# EAGLE design multiple valve controller v2.0 (EAGLE 9.6.2)
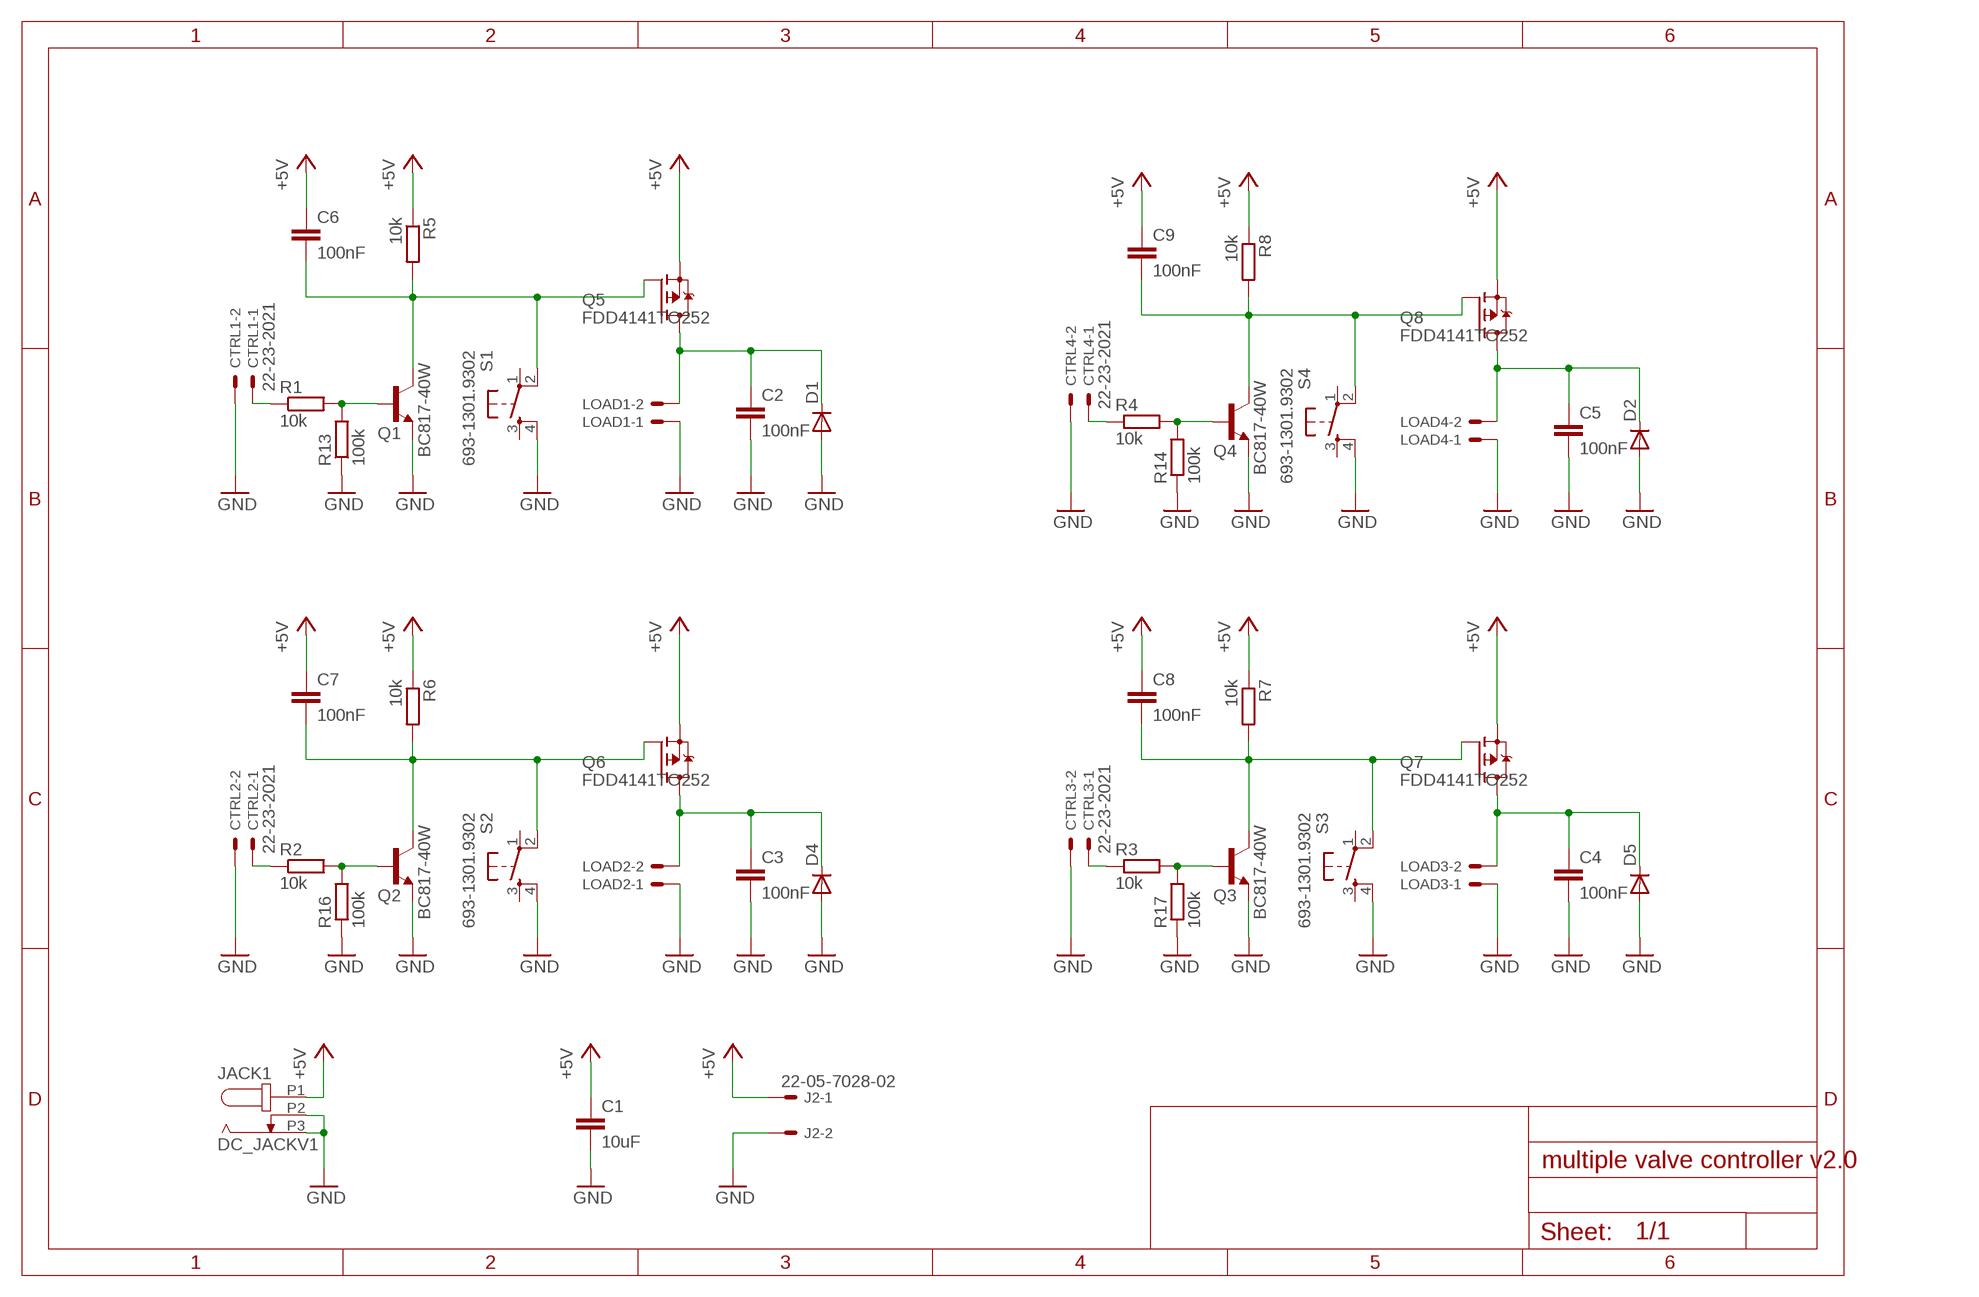
[diagram p0: schematic, sheet 1, part 1 of 2]
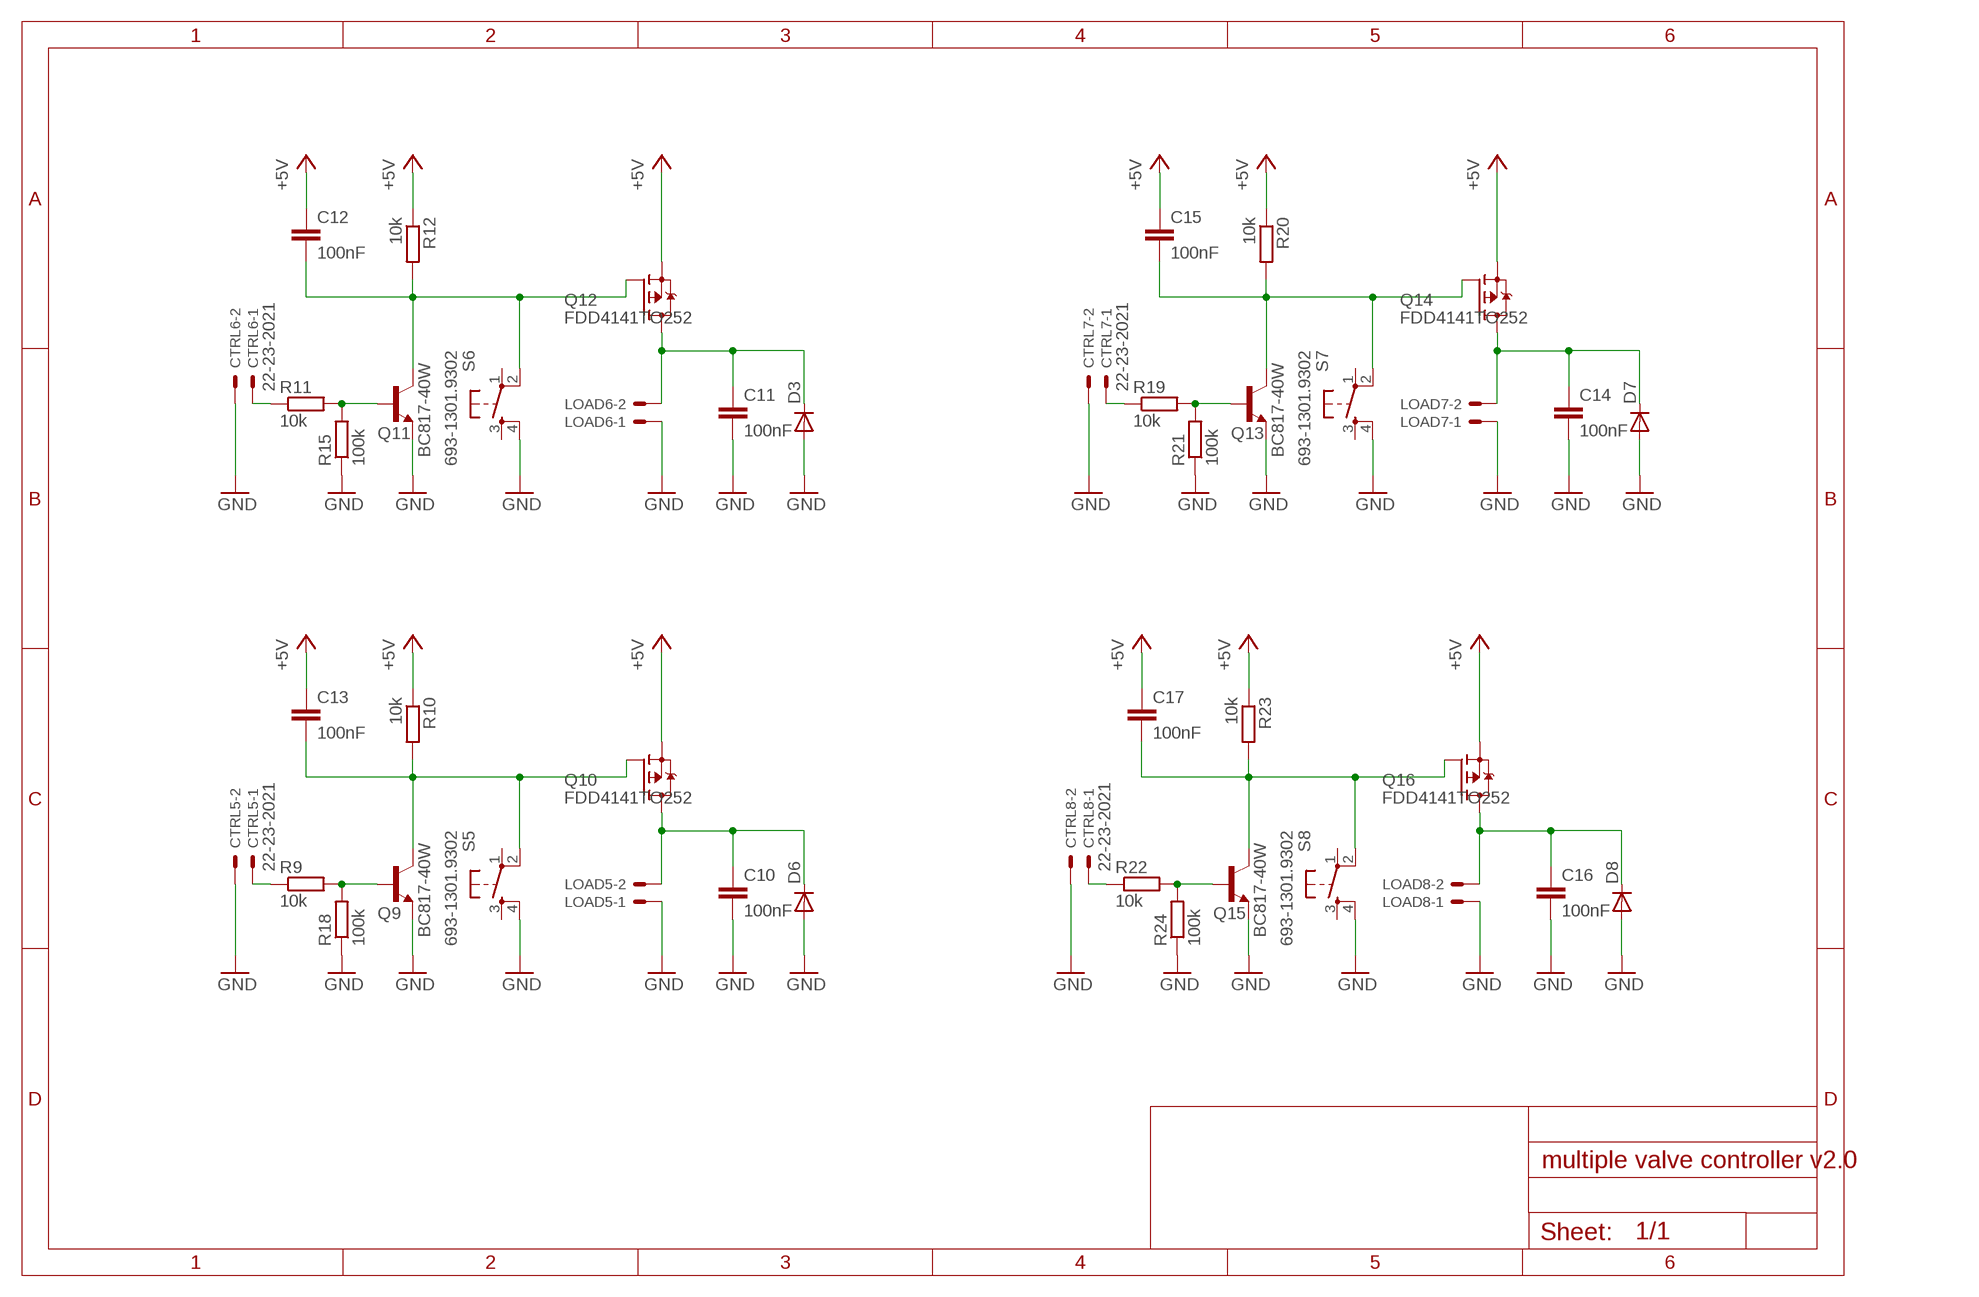
[diagram p1: schematic, sheet 1, part 2 of 2]

## Parts
C1  10uF  C-EUC1210  [C1210]
C2  100nF  C-EUC1210  [C1210]
C3  100nF  C-EUC1210  [C1210]
C4  100nF  C-EUC1210  [C1210]
C5  100nF  C-EUC1210  [C1210]
C6  100nF  C-EUC0603  [C0603]
C7  100nF  C-EUC0603  [C0603]
C8  100nF  C-EUC0603  [C0603]
C9  100nF  C-EUC0603  [C0603]
C10  100nF  C-EUC1210  [C1210]
C11  100nF  C-EUC1210  [C1210]
C12  100nF  C-EUC0603  [C0603]
C13  100nF  C-EUC0603  [C0603]
C14  100nF  C-EUC1210  [C1210]
C15  100nF  C-EUC0603  [C0603]
C16  100nF  C-EUC1210  [C1210]
C17  100nF  C-EUC0603  [C0603]
CTRL1  22-23-2021  [22-23-2021]
CTRL2  22-23-2021  [22-23-2021]
CTRL3  22-23-2021  [22-23-2021]
CTRL4  22-23-2021  [22-23-2021]
CTRL5  22-23-2021  [22-23-2021]
CTRL6  22-23-2021  [22-23-2021]
CTRL7  22-23-2021  [22-23-2021]
CTRL8  22-23-2021  [22-23-2021]
D1  DIODE-SOD323-R  [SOD323-R]
D2  DIODE-SOD323-R  [SOD323-R]
D3  DIODE-SOD323-R  [SOD323-R]
D4  DIODE-SOD323-R  [SOD323-R]
D5  DIODE-SOD323-R  [SOD323-R]
D6  DIODE-SOD323-R  [SOD323-R]
D7  DIODE-SOD323-R  [SOD323-R]
D8  DIODE-SOD323-R  [SOD323-R]
J2  22-05-7028-02  [7395-02]
JACK1  DC_JACKV1  [DC_POWER_INPUT]
LOAD1  22-23-2021  [22-23-2021]
LOAD2  22-23-2021  [22-23-2021]
LOAD3  22-23-2021  [22-23-2021]
LOAD4  22-23-2021  [22-23-2021]
LOAD5  22-23-2021  [22-23-2021]
LOAD6  22-23-2021  [22-23-2021]
LOAD7  22-23-2021  [22-23-2021]
LOAD8  22-23-2021  [22-23-2021]
Q1  BC817-40W  BC817  [SOT323-BEC]
Q2  BC817-40W  BC817  [SOT323-BEC]
Q3  BC817-40W  BC817  [SOT323-BEC]
Q4  BC817-40W  BC817  [SOT323-BEC]
Q5  FDD4141TO252  [TO252]
Q6  FDD4141TO252  [TO252]
Q7  FDD4141TO252  [TO252]
Q8  FDD4141TO252  [TO252]
Q9  BC817-40W  BC817  [SOT323-BEC]
Q10  FDD4141TO252  [TO252]
Q11  BC817-40W  BC817  [SOT323-BEC]
Q12  FDD4141TO252  [TO252]
Q13  BC817-40W  BC817  [SOT323-BEC]
Q14  FDD4141TO252  [TO252]
Q15  BC817-40W  BC817  [SOT323-BEC]
Q16  FDD4141TO252  [TO252]
R1  10k  R-EU_R0402  [R0402]
R2  10k  R-EU_R0402  [R0402]
R3  10k  R-EU_R0402  [R0402]
R4  10k  R-EU_R0402  [R0402]
R5  10k  R-EU_R0603  [R0603]
R6  10k  R-EU_R0603  [R0603]
R7  10k  R-EU_R0603  [R0603]
R8  10k  R-EU_R0603  [R0603]
R9  10k  R-EU_R0402  [R0402]
R10  10k  R-EU_R0603  [R0603]
R11  10k  R-EU_R0402  [R0402]
R12  10k  R-EU_R0603  [R0603]
R13  100k  R-EU_R0402  [R0402]
R14  100k  R-EU_R0402  [R0402]
R15  100k  R-EU_R0402  [R0402]
R16  100k  R-EU_R0402  [R0402]
R17  100k  R-EU_R0402  [R0402]
R18  100k  R-EU_R0402  [R0402]
R19  10k  R-EU_R0402  [R0402]
R20  10k  R-EU_R0603  [R0603]
R21  100k  R-EU_R0402  [R0402]
R22  10k  R-EU_R0402  [R0402]
R23  10k  R-EU_R0603  [R0603]
R24  100k  R-EU_R0402  [R0402]
S1  693-1301.9302  TAC_SWITCHPTH  [TACTILE-PTH]
S2  693-1301.9302  TAC_SWITCHPTH  [TACTILE-PTH]
S3  693-1301.9302  TAC_SWITCHPTH  [TACTILE-PTH]
S4  693-1301.9302  TAC_SWITCHPTH  [TACTILE-PTH]
S5  693-1301.9302  TAC_SWITCHPTH  [TACTILE-PTH]
S6  693-1301.9302  TAC_SWITCHPTH  [TACTILE-PTH]
S7  693-1301.9302  TAC_SWITCHPTH  [TACTILE-PTH]
S8  693-1301.9302  TAC_SWITCHPTH  [TACTILE-PTH]

## Nets
+5V: C1.1 C6.1 C7.1 C8.1 C9.1 C12.1 C13.1 C15.1 C17.1 J2.1 JACK1.P1 Q5.2(S) Q6.2(S) Q7.2(S) Q8.2(S) Q10.2(S) Q12.2(S) Q14.2(S) Q16.2(S) R5.1 R6.1 R7.1 R8.1 R10.1 R12.1 R20.1 R23.1
GND: C1.2 C2.2 C3.2 C4.2 C5.2 C10.2 C11.2 C14.2 C16.2 CTRL1.2 CTRL2.2 CTRL3.2 CTRL4.2 CTRL5.2 CTRL6.2 CTRL7.2 CTRL8.2 D1.A D2.A D3.A D4.A D5.A D6.A D7.A D8.A J2.2 JACK1.P2 JACK1.P3 LOAD1.1 LOAD2.1 LOAD3.1 LOAD4.1 LOAD5.1 LOAD6.1 LOAD7.1 LOAD8.1 Q1.E Q2.E Q3.E Q4.E Q9.E Q11.E Q13.E Q15.E R13.1 R14.1 R15.1 R16.1 R17.1 R18.1 R21.1 R24.1 S1.4 S2.4 S3.4 S4.4 S5.4 S6.4 S7.4 S8.4
N$1: CTRL1.1 R1.1
N$2: C3.1 D4.C LOAD2.2 Q6.3(D)
N$3: C8.2 Q3.C Q7.1(G) R7.2 S3.2
N$4: Q2.B R2.2 R16.2
N$5: CTRL2.1 R2.1
N$6: C4.1 D5.C LOAD3.2 Q7.3(D)
N$7: C13.2 Q9.C Q10.1(G) R10.2 S5.2
N$8: Q3.B R3.2 R17.2
N$9: C2.1 D1.C LOAD1.2 Q5.3(D)
N$10: CTRL3.1 R3.1
N$11: C5.1 D2.C LOAD4.2 Q8.3(D)
N$12: C12.2 Q11.C Q12.1(G) R12.2 S6.2
N$13: Q4.B R4.2 R14.2
N$14: CTRL4.1 R4.1
N$17: C7.2 Q2.C Q6.1(G) R6.2 S2.2
N$18: C9.2 Q4.C Q8.1(G) R8.2 S4.2
N$19: Q1.B R1.2 R13.2
N$25: C15.2 Q13.C Q14.1(G) R20.2 S7.2
N$31: C17.2 Q15.C Q16.1(G) R23.2 S8.2
N$49: C10.1 D6.C LOAD5.2 Q10.3(D)
N$51: Q9.B R9.2 R18.2
N$52: CTRL5.1 R9.1
N$53: C11.1 D3.C LOAD6.2 Q12.3(D)
N$55: Q11.B R11.2 R15.2
N$56: CTRL6.1 R11.1
N$61: C6.2 Q1.C Q5.1(G) R5.2 S1.2
N$150: C14.1 D7.C LOAD7.2 Q14.3(D)
N$170: Q13.B R19.2 R21.2
N$200: CTRL7.1 R19.1
N$210: C16.1 D8.C LOAD8.2 Q16.3(D)
N$230: Q15.B R22.2 R24.2
N$240: CTRL8.1 R22.1
Unconnected: S1.1 S1.3 S2.1 S2.3 S3.1 S3.3 S4.1 S4.3 S5.1 S5.3 S6.1 S6.3 S7.1 S7.3 S8.1 S8.3

## Library data of the parts
C1-C17 = rcl:C-EU: CAPACITOR, European symbol
CTRL1-CTRL8 LOAD1-LOAD8 = con-molex:22-23-2021: .100" (2.54mm) Center Header - 2 Pin; MF: MOLEX; MPN: 22-23-2021; OC_FARNELL: 1462926; OC_NEWARK: 25C3832
D1-D8 = diode:DIODE-: DIODE
J2 = con-molex:22-?-02: CONNECTOR wire to board 2.54 mm (.1 inch) pitch header; OC_FARNELL: 9731601; OC_NEWARK: unknown
JACK1 = CNP-miscellaneous:DC_JACK
Q1-Q4 Q9 Q11 Q13 Q15 = transistor-npn:BC817*: NPN Transistor
Q5-Q8 Q10 Q12 Q14 Q16 = transistor-fet:FDD4141: P-Channel PowerTrench® MOSFET Source: FDD4141.pdf
R1-R24 = rcl:R-EU_: RESISTOR, European symbol
S1-S8 = SparkFun-Electromechanical:TAC_SWITCH: Momentary Switch Button commonly used for reset or general input. Spark Fun Electronics SKU : COM-00097 SMT- SWCH-08247

## Board
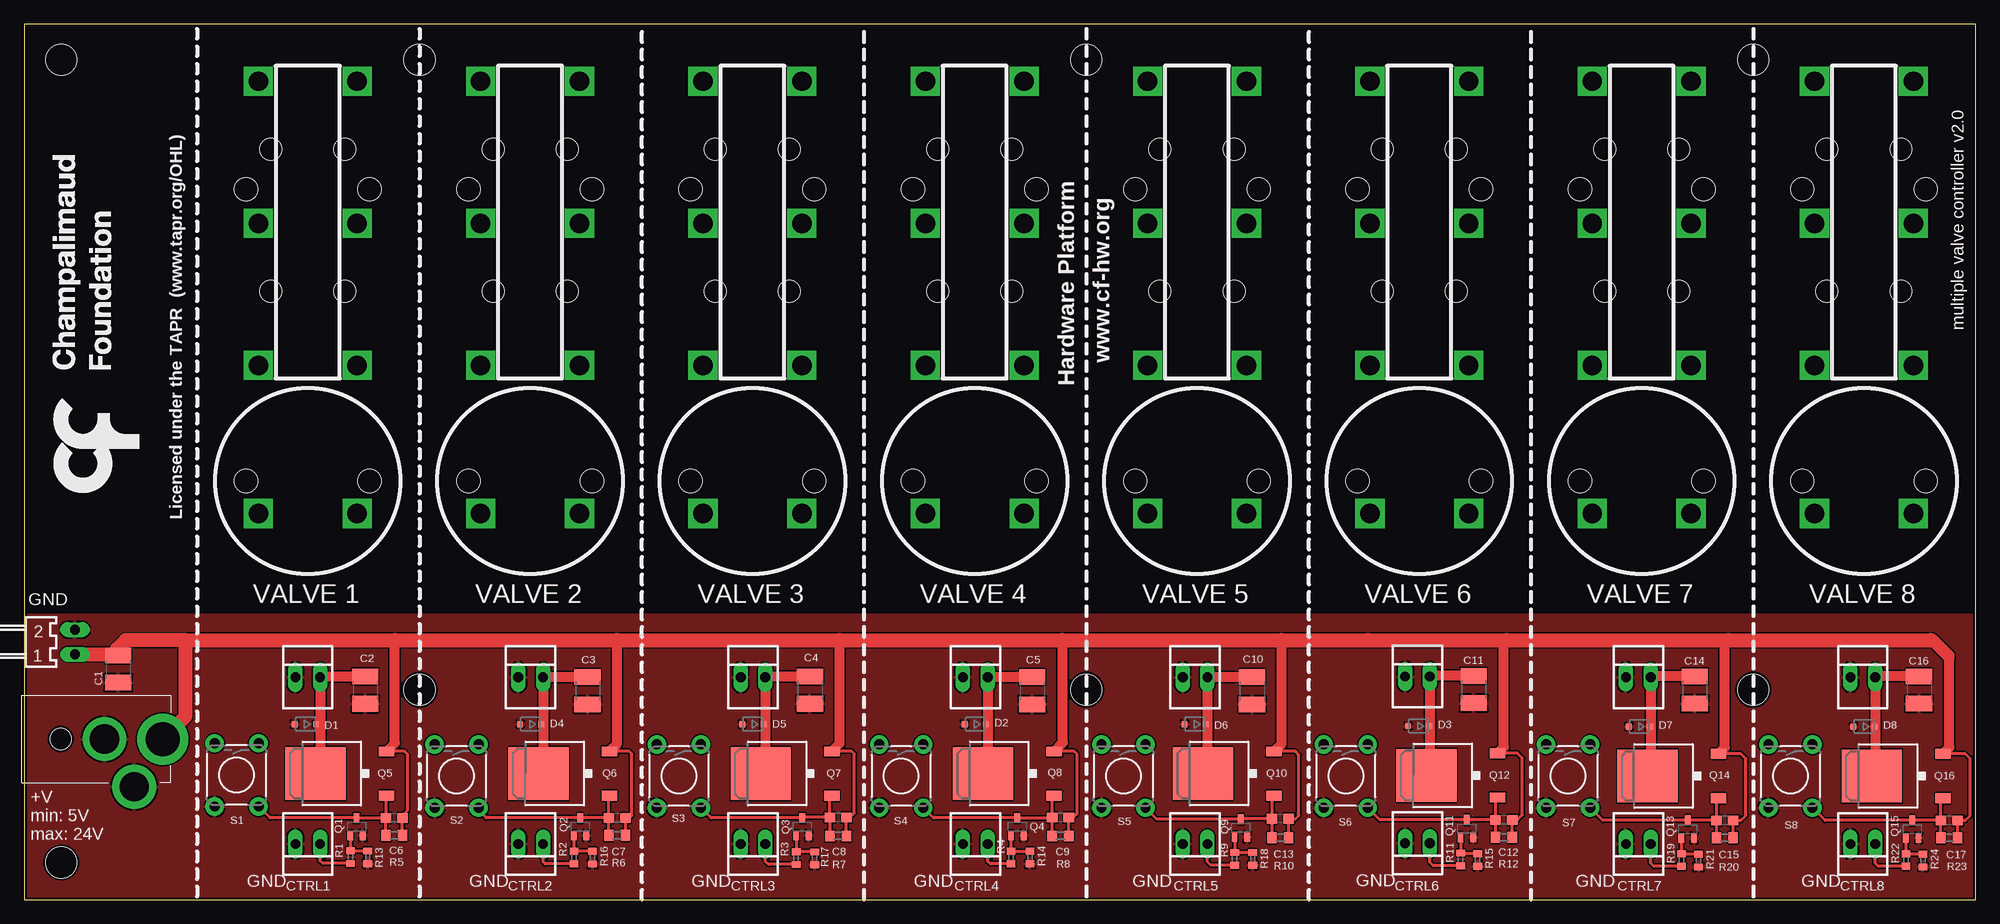
[diagram p2: board, top side]
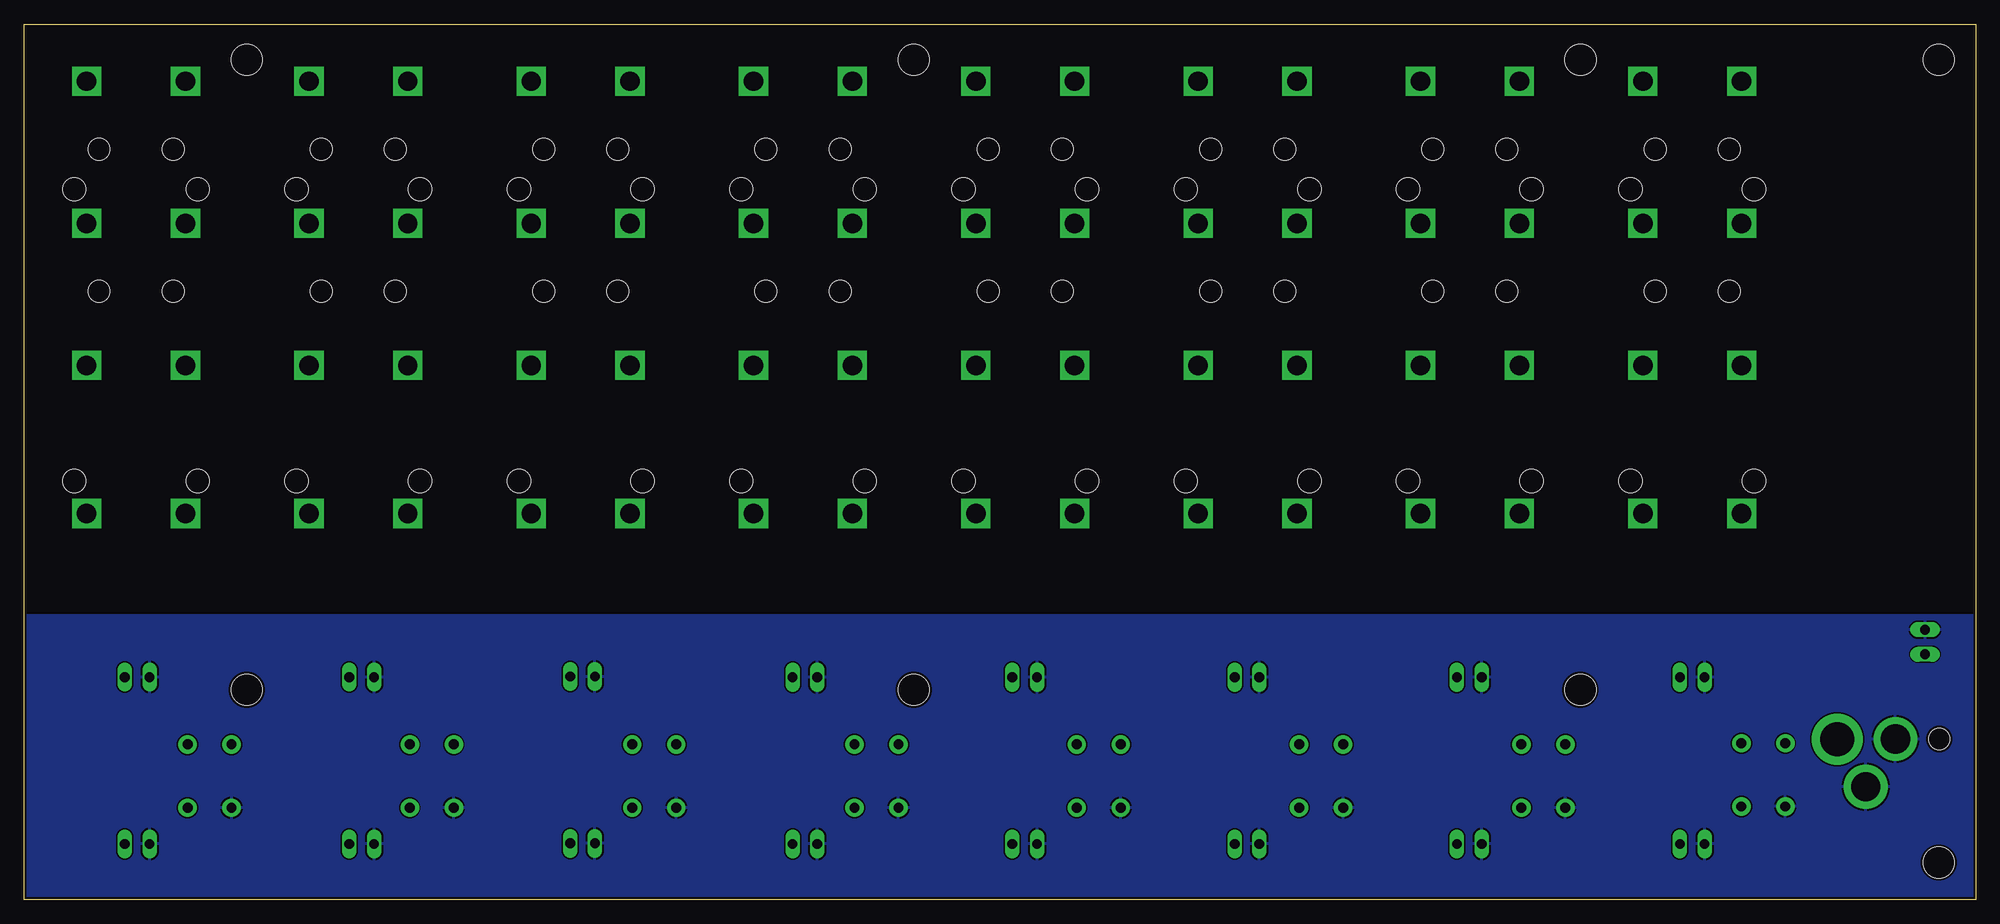
[diagram p3: board, bottom side, seen from below]

Size 200.66 x 90 mm. Coordinates in mm from the lower left corner, seen from the top.
Outline: 0,0 200.66,0 200.66,90 0,90 0,0
Copper layers (1*16): Top 0.018mm / dielectric 1.55mm / Bottom 0.018mm
Design rules "eC_2Layer_PClass6_BaseCopperO18_eCDefault": minimum track width 0.15mm, minimum drill 0.35mm, track to track 0.15mm, track to pad 0.15mm, pad to pad 0.15mm, via to via 0.15mm, smd to smd 0mil, copper to edge 0.25mm, drill to drill 0.35mm, minimum pad ring 0.175mm, minimum via ring 0.125mm, stop-mask expansion 0mil, vias tented up to drill 0.45mm, thermal gap 0.2mm
Holes 3.2 mm at 177.8,86.36 3.81,3.81 109.22,86.36 40.64,86.36 3.81,86.36 177.8,21.59 109.22,21.59 40.64,21.59
Holes 2.26 mm at 124.4,77.16 116.78,77.16 124.4,62.55 116.78,62.55 147.26,77.16 139.64,77.16 147.26,62.55 139.64,62.55 170.12,77.16 162.5,77.16 170.12,62.55 162.5,62.55 192.98,77.16 185.36,77.16 192.98,62.55 185.36,62.55 32.96,77.16 25.34,77.16 32.96,62.55 25.34,62.55 55.82,77.16 48.2,77.16 55.82,62.55 48.2,62.55 78.68,77.16 71.06,77.16 78.68,62.55 71.06,62.55 101.54,77.16 93.92,77.16 101.54,62.55 93.92,62.55
Holes 2.4 mm at 114.24,43.04 126.94,43.04 114.24,73.04 126.94,73.04 137.1,43.04 149.8,43.04 137.1,73.04 149.8,73.04 159.96,43.04 172.66,43.04 159.96,73.04 172.66,73.04 182.82,43.04 195.52,43.04 182.82,73.04 195.52,73.04 22.8,43.04 35.5,43.04 22.8,73.04 35.5,73.04 45.66,43.04 58.36,43.04 45.66,73.04 58.36,73.04 68.52,43.04 81.22,43.04 68.52,73.04 81.22,73.04 91.38,43.04 104.08,43.04 91.38,73.04 104.08,73.04

### Footprints (pad centres in the part's own frame; a part is rotated, then mirrored left to right if it is on the bottom)
C1210 = smd 1.6 x 2.7: 1 -1.4,0; 2 1.4,0
C0603 = smd 1.1 x 1: 1 -0.85,0; 2 0.85,0
22-23-2021 = drill 1 long: 1 -1.27,0; 2 1.27,0
SOD323-R = smd 0.6 x 0.6: A 1.1,0; C -1.1,0
7395-02 = drill 1.016 long: 1 1.27,0; 2 -1.27,0
DC_POWER_INPUT = drill 3.5: P1 8.5,0 | drill 3: P2 2.5,0; P3 5.55,-4.9 | hole 2.2: -2,0
SOT323-BEC = smd 0.6 x 1: B -0.65,-0.9; C 0,0.9; E 0.65,-0.9
TO252 = smd 1 x 1.6: 1 -2.28,-4.8; 2 2.28,-4.8 | smd 5.4 x 6.2: 3 0,2.5
R0402 = smd 0.7 x 0.9: 1 -0.65,0; 2 0.65,0
R0603 = smd 1 x 1.1: 1 -0.85,0; 2 0.85,0
TACTILE-PTH = drill 1.016 pad 1.88: 1 -3.251,2.261; 2 3.251,2.261; 3 -3.251,-2.261; 4 3.251,-2.261

### Placement (x,y rotation side)
C1  9.67,23.7 270 top
C2  35.06,21.53 270 top
C3  57.92,21.47 270 top
C4  80.78,21.53 270 top
C5  103.64,21.47 270 top
C6  38.04,8.38 180 top
C7  60.96,8.38 180 top
C8  83.69,8.45 180 top
C9  106.55,8.45 180 top
C10  126.25,21.47 270 top
C11  149.05,21.6 270 top
C12  152.15,8.19 180 top
C13  129.16,8.32 180 top
C14  171.76,21.54 270 top
C15  174.86,8.13 180 top
C16  194.84,21.54 270 top
C17  197.94,8.13 180 top
CTRL1  29.15,5.71 180 top
CTRL2  52.07,5.71 180 top
CTRL3  74.93,5.71 180 top
CTRL4  97.79,5.71 180 top
CTRL5  120.4,5.71 180 top
CTRL6  143.26,5.78 180 top
CTRL7  165.97,5.72 180 top
CTRL8  189.05,5.72 180 top
D1  28.89,18.03 180 top
D2  97.79,18.03 180 top
D3  143.38,17.84 180 top
D4  52.07,18.03 180 top
D5  74.93,18.03 180 top
D6  120.4,18.03 180 top
D7  166.1,17.78 180 top
D8  189.18,17.78 180 top
J2  5.21,26.49 270 top
JACK1  5.75,16.5 0 top
LOAD1  29.15,22.86 0 top
LOAD2  52.07,22.86 0 top
LOAD3  74.93,22.86 0 top
LOAD4  97.79,22.86 0 top
LOAD5  120.4,22.86 0 top
LOAD6  143.26,22.92 0 top
LOAD7  165.97,22.86 0 top
LOAD8  189.05,22.86 0 top
Q1  34.16,7.49 0 top
Q2  57.15,7.49 0 top
Q3  80.01,7.49 0 top
Q4  102.11,7.49 0 top
Q5  32.45,12.95 90 top
Q6  55.37,12.95 90 top
Q7  78.23,12.95 90 top
Q8  101.09,12.95 90 top
Q9  125.09,7.37 0 top
Q10  123.7,12.95 90 top
Q11  148.34,7.3 0 top
Q12  146.69,12.76 90 top
Q13  171.05,7.24 0 top
Q14  169.4,12.7 90 top
Q15  194.13,7.24 0 top
Q16  192.48,12.7 90 top
R1  33.55,4.36 90 top
R2  56.52,4.32 90 top
R3  79.37,4.25 90 top
R4  101.47,4.32 90 top
R5  38.04,6.6 180 top
R6  60.96,6.6 180 top
R7  83.69,6.54 180 top
R8  106.55,6.54 180 top
R9  124.46,4.19 90 top
R10  129.16,6.36 180 top
R11  147.7,4.13 90 top
R12  152.15,6.41 180 top
R13  35.31,4.34 90 top
R14  103.41,4.32 90 top
R15  149.44,4.07 90 top
R16  58.43,4.31 90 top
R17  81.27,4.24 90 top
R18  126.32,4.18 90 top
R19  170.41,4.07 90 top
R20  174.86,6.35 180 top
R21  172.16,4.01 90 top
R22  193.5,4.07 90 top
R23  197.94,6.35 180 top
R24  195.24,4.01 90 top
S1  21.83,12.82 270 top
S2  44.45,12.7 270 top
S3  67.31,12.7 270 top
S4  90.17,12.7 270 top
S5  113.03,12.7 270 top
S6  135.89,12.7 270 top
S7  158.75,12.7 270 top
S8  181.61,12.7 270 top
U$1  [LOGO_5]  6.1,44.91 90 top

### Tracks (layer width: path | path; a pad name or v marks a point on that pad's centre or on a via)
+5V
  Top 0.305: R7.1 C8.1 84.9,8.45 85.34,8.89 85.34,14.99 85.09,15.24 Q7.2 | R5.1 C6.1 38.89,8.66 39.37,9.14 39.37,14.99 39.24,15.11 39.12,15.24 Q5.2 | R10.1 C13.1 130.75,8.32 131.06,8.64 131.06,14.86 130.68,15.24 Q10.2 | R12.1 C12.1 153.54,8.19 154.05,8.7 154.05,14.54 153.54,15.05 Q12.2 | R6.1 C7.1 62.23,8.38 62.48,8.64 62.48,14.99 62.23,15.24 Q6.2 | R8.1 C9.1 107.89,8.45 108.27,8.83 108.27,14.92 107.95,15.24 Q8.2 | R20.1 C15.1 176.51,8.13 177.02,8.64 177.02,14.48 176.51,14.99 Q14.2 | R23.1 C17.1 199.59,8.13 200.1,8.64 200.1,14.48 199.59,14.99 Q16.2
  Top 1.016: 129.29,26.67 129.29,16.02 Q10.2 | 134.56,26.86 138.18,26.67 | Q12.2 152.15,15.7 152.15,26.42 152.4,26.67 | Q14.2 174.86,15.64 174.86,26.27 175.26,26.67 | 197.94,24.77 197.94,15.64 Q16.2 | 196.04,26.67 197.94,24.77 | 196.23,26.86 197.94,25.15 197.94,24.77 | Q6.2 60.96,16.02 60.96,26.67 | Q7.2 83.82,16.02 83.82,26.67 | Q8.2 106.81,16.15 106.81,26.54 106.68,26.67 | Q5.2 38.1,16.09 38.1,26.67
  Top 1.422: 16.54,26.67 38.1,26.67 60.96,26.67 83.82,26.67 106.68,26.67 129.29,26.67 138.18,26.67 152.4,26.67 175.26,26.67 196.03,26.67 196.04,26.67 | 16.54,26.67 16.54,18.79 JACK1.P1 | 16.54,26.67 10.42,26.67 9.55,25.8 9.55,25.22 | J2.1 9.55,25.22 | 9.55,25.22 C1.1
GND
  pour Top: 0,0 200.66,0 200.66,29.21 0,29.21
  pour Bottom: 0,0 200.66,0 200.66,29.21 0,29.21
N$1
  Top 0.305: R1.1 30.7,3.71 30.43,3.98 CTRL1.1
N$2
  Top 0.305: D4.C 53.34,18.03
  Top 0.406: 58.67,22.69 C3.1
  Top 1.016: 53.34,22.82 LOAD2.2 | LOAD2.2 53.34,18.03 53.34,13.42 Q6.3 | C3.1 LOAD2.2
N$3
  Top 0.305: C8.2 R7.2 | C8.2 80.06,8.45 Q3.C 70.63,8.39 S3.2 | C8.2 82.84,10.48 Q7.1
N$4
  Top 0.305: Q2.B 56.5,4.98 R2.2 56.53,4.96 R16.2
N$5
  Top 0.305: R2.1 53.55,3.67 53.34,3.87 CTRL2.1
N$6
  Top 0.305: D5.C 76.2,18.03
  Top 0.406: 81.79,22.69 C4.1
  Top 1.016: 76.2,22.88 LOAD3.2 | LOAD3.2 76.2,18.03 76.2,13.42 Q7.3 | C4.1 76.28,22.93 LOAD3.2
N$7
  Top 0.305: R10.2 C13.2 | C13.2 125.15,8.32 Q9.C 116.47,8.27 S5.2 | Q10.1 128.31,10.48 C13.2
N$8
  Top 0.305: Q3.B 79.36,4.92 R3.2 79.38,4.89 R17.2
N$9
  Top 0.305: D1.C 30.42,18.03
  Top 1.016: 30.42,22.88 LOAD1.2 | LOAD1.2 30.42,18.03 30.42,13.68 Q5.3 | C2.1 30.49,22.93 LOAD1.2
N$10
  Top 0.305: R3.1 76.53,3.6 76.2,3.94 CTRL3.1
N$11
  Top 0.305: D2.C 99.06,18.03
  Top 0.406: 101.6,22.69 C5.1
  Top 1.016: Q8.3 99.06,13.42 99.06,18.03 LOAD4.2 C5.1
N$12
  Top 0.305: R12.2 C12.2 | C12.2 151.3,10.29 Q12.1 | S6.2 139.4,8.2 Q11.C C12.2
N$13
  Top 0.305: Q4.B 101.46,4.98 R4.2 R14.2
N$14
  Top 0.305: R4.1 99.33,3.67 99.06,3.94 CTRL4.1
N$15  (via drill 2)
  other vias: 24.07,54.94
N$16  (via drill 2)
  other vias: 34.23,54.94
N$17
  Top 0.305: R6.2 C7.2 | S2.2 46.71,9.17 47.49,8.39 Q2.C 60.1,8.39 C7.2 | C7.2 60.11,10.61 Q6.1
N$18
  Top 0.305: R8.2 C9.2 | 105.7,8.25 105.7,8.18 | 105.7,8.25 C9.2 | 105.7,8.25 105.56,8.39 Q4.C 93.49,8.39 S4.2 | C9.2 105.7,10.48 Q8.1
N$19
  Top 0.305: R13.2 35.29,5.01 R1.2 33.51,5.05 Q1.B
N$20  (via drill 2)
  other vias: 24.07,69.54
N$21  (via drill 2)
  other vias: 34.23,69.54
N$22  (via drill 2)
  other vias: 34.23,84.14
N$23  (via drill 2)
  other vias: 24.07,84.14
N$24  (via drill 2)
  other vias: 34.23,39.7
N$25
  Top 0.305: R20.2 C15.2 | C15.2 174.01,10.23 Q14.1 | S7.2 162.32,8.14 Q13.C C15.2
N$26  (via drill 2)
  other vias: 24.07,39.7
N$27  (via drill 2)
  other vias: 46.93,54.94
N$28  (via drill 2)
  other vias: 57.09,54.94
N$29  (via drill 2)
  other vias: 46.93,69.54
N$30  (via drill 2)
  other vias: 57.09,69.54
N$31
  Top 0.305: R23.2 C17.2 | C17.2 197.09,10.23 Q16.1 | S8.2 185.18,8.14 Q15.C 194.14,8.13 C17.2
N$32  (via drill 2)
  other vias: 115.51,54.94
N$33  (via drill 2)
  other vias: 57.09,84.14
N$34  (via drill 2)
  other vias: 46.93,84.14
N$35  (via drill 2)
  other vias: 57.09,39.7
N$36  (via drill 2)
  other vias: 46.93,39.7
N$37  (via drill 2)
  other vias: 69.79,54.94
N$38  (via drill 2)
  other vias: 79.95,54.94
N$39  (via drill 2)
  other vias: 69.79,69.54
N$40  (via drill 2)
  other vias: 79.95,69.54
N$41  (via drill 2)
  other vias: 79.95,84.14
N$42  (via drill 2)
  other vias: 69.79,84.14
N$43  (via drill 2)
  other vias: 79.95,39.7
N$44  (via drill 2)
  other vias: 69.79,39.7
N$45  (via drill 2)
  other vias: 92.65,54.94
N$46  (via drill 2)
  other vias: 102.81,54.94
N$47  (via drill 2)
  other vias: 92.65,69.54
N$48  (via drill 2)
  other vias: 102.81,69.54
N$49
  Top 0.305: D6.C 121.67,18.03
  Top 0.406: 127,22.69 C10.1
  Top 1.016: 121.67,22.82 LOAD5.2 | LOAD5.2 121.67,18.03 121.67,13.42 Q10.3 | C10.1 LOAD5.2
N$50  (via drill 2)
  other vias: 125.67,54.94
N$51
  Top 0.305: Q9.B 124.44,4.86 R9.2 R18.2
N$52
  Top 0.305: R9.1 122,3.54 121.67,3.87 CTRL5.1
N$53
  Top 0.305: D3.C 144.53,17.84
  Top 0.406: 150.05,22.75 C11.1
  Top 1.016: 144.53,22.95 LOAD6.2 | LOAD6.2 144.53,17.84 144.53,13.1 Q12.3 | C11.1 144.6,23 LOAD6.2
N$54  (via drill 2)
  other vias: 115.51,69.54
N$55
  Top 0.305: Q11.B 147.69,4.79 R11.2 149.63,4.78 R15.2
N$56
  Top 0.305: R11.1 144.86,3.48 144.53,3.81 CTRL6.1
N$57  (via drill 2)
  other vias: 102.81,84.14
N$58  (via drill 2)
  other vias: 92.65,84.14
N$59  (via drill 2)
  other vias: 102.81,39.7
N$60  (via drill 2)
  other vias: 92.65,39.7
N$61
  Top 0.305: R5.2 C6.2 | 37.39,10.54 Q5.1 37.19,10.61 C6.2 | C6.2 37.38,8.39 Q1.C 25.27,8.39 S1.2
N$62  (via drill 2)
  other vias: 125.67,69.54
N$63  (via drill 2)
  other vias: 125.67,84.14
N$64  (via drill 2)
  other vias: 115.51,84.14
N$65  (via drill 2)
  other vias: 125.67,39.7
N$66  (via drill 2)
  other vias: 115.51,39.7
N$67  (via drill 2)
  other vias: 138.37,54.94
N$68  (via drill 2)
  other vias: 148.53,54.94
N$69  (via drill 2)
  other vias: 138.37,69.54
N$70  (via drill 2)
  other vias: 148.53,69.54
N$71  (via drill 2)
  other vias: 148.53,84.14
N$72  (via drill 2)
  other vias: 138.37,84.14
N$73  (via drill 2)
  other vias: 148.53,39.7
N$74  (via drill 2)
  other vias: 138.37,39.7
N$75  (via drill 2)
  other vias: 161.23,54.94
N$76  (via drill 2)
  other vias: 171.39,54.94
N$77  (via drill 2)
  other vias: 161.23,69.54
N$78  (via drill 2)
  other vias: 171.39,69.54
N$79  (via drill 2)
  other vias: 171.39,84.14
N$80  (via drill 2)
  other vias: 161.23,84.14
N$81  (via drill 2)
  other vias: 171.39,39.7
N$82  (via drill 2)
  other vias: 161.23,39.7
N$83  (via drill 2)
  other vias: 184.09,54.94
N$84  (via drill 2)
  other vias: 194.25,54.94
N$85  (via drill 2)
  other vias: 184.09,69.54
N$86  (via drill 2)
  other vias: 194.25,69.54
N$87  (via drill 2)
  other vias: 194.25,84.14
N$88  (via drill 2)
  other vias: 184.09,84.14
N$89  (via drill 2)
  other vias: 194.25,39.7
N$90  (via drill 2)
  other vias: 184.09,39.7
N$150
  Top 0.305: D7.C 167.24,17.78
  Top 0.406: 172.76,22.69 C14.1
  Top 1.016: 167.24,22.89 LOAD7.2 | LOAD7.2 167.24,17.78 167.24,13.04 Q14.3 | C14.1 167.31,22.94 LOAD7.2
N$170
  Top 0.305: Q13.B 170.4,4.73 R19.2 172.34,4.72 R21.2
N$200
  Top 0.305: R19.1 167.57,3.42 167.24,3.75 CTRL7.1
N$210
  Top 0.305: D8.C 190.32,17.78
  Top 0.406: 195.85,22.69 C16.1
  Top 1.016: 190.32,22.89 LOAD8.2 | LOAD8.2 190.32,17.78 190.32,13.04 Q16.3 | C16.1 190.4,22.94 LOAD8.2
N$230
  Top 0.305: Q15.B 193.48,4.73 R22.2 195.43,4.72 R24.2
N$240
  Top 0.305: R22.1 190.65,3.42 190.32,3.75 CTRL8.1

### Text on the board
tPlace: multiple valve controller v2.0 | www.cf-hw.org | Hardware Platform | Licensed under the TAPR (www.tapr.org/OHL) | GND | VALVE 1 | VALVE 2 | VALVE 3 | VALVE 4 | VALVE 5 | VALVE 6 | VALVE 7 | VALVE 8 | +V / min: 5V / max: 24V | GND | GND | GND | GND | GND | GND | GND | GND | Licensed under the TAPR Open / Hardware License (www.tapr.org/OHL) / / Copyright 2020 Hardware Platform